# Altium schematic sheet MCU.SchDoc
size 431 x 279 mm; SheetNumber: 5; SheetTotal: 5
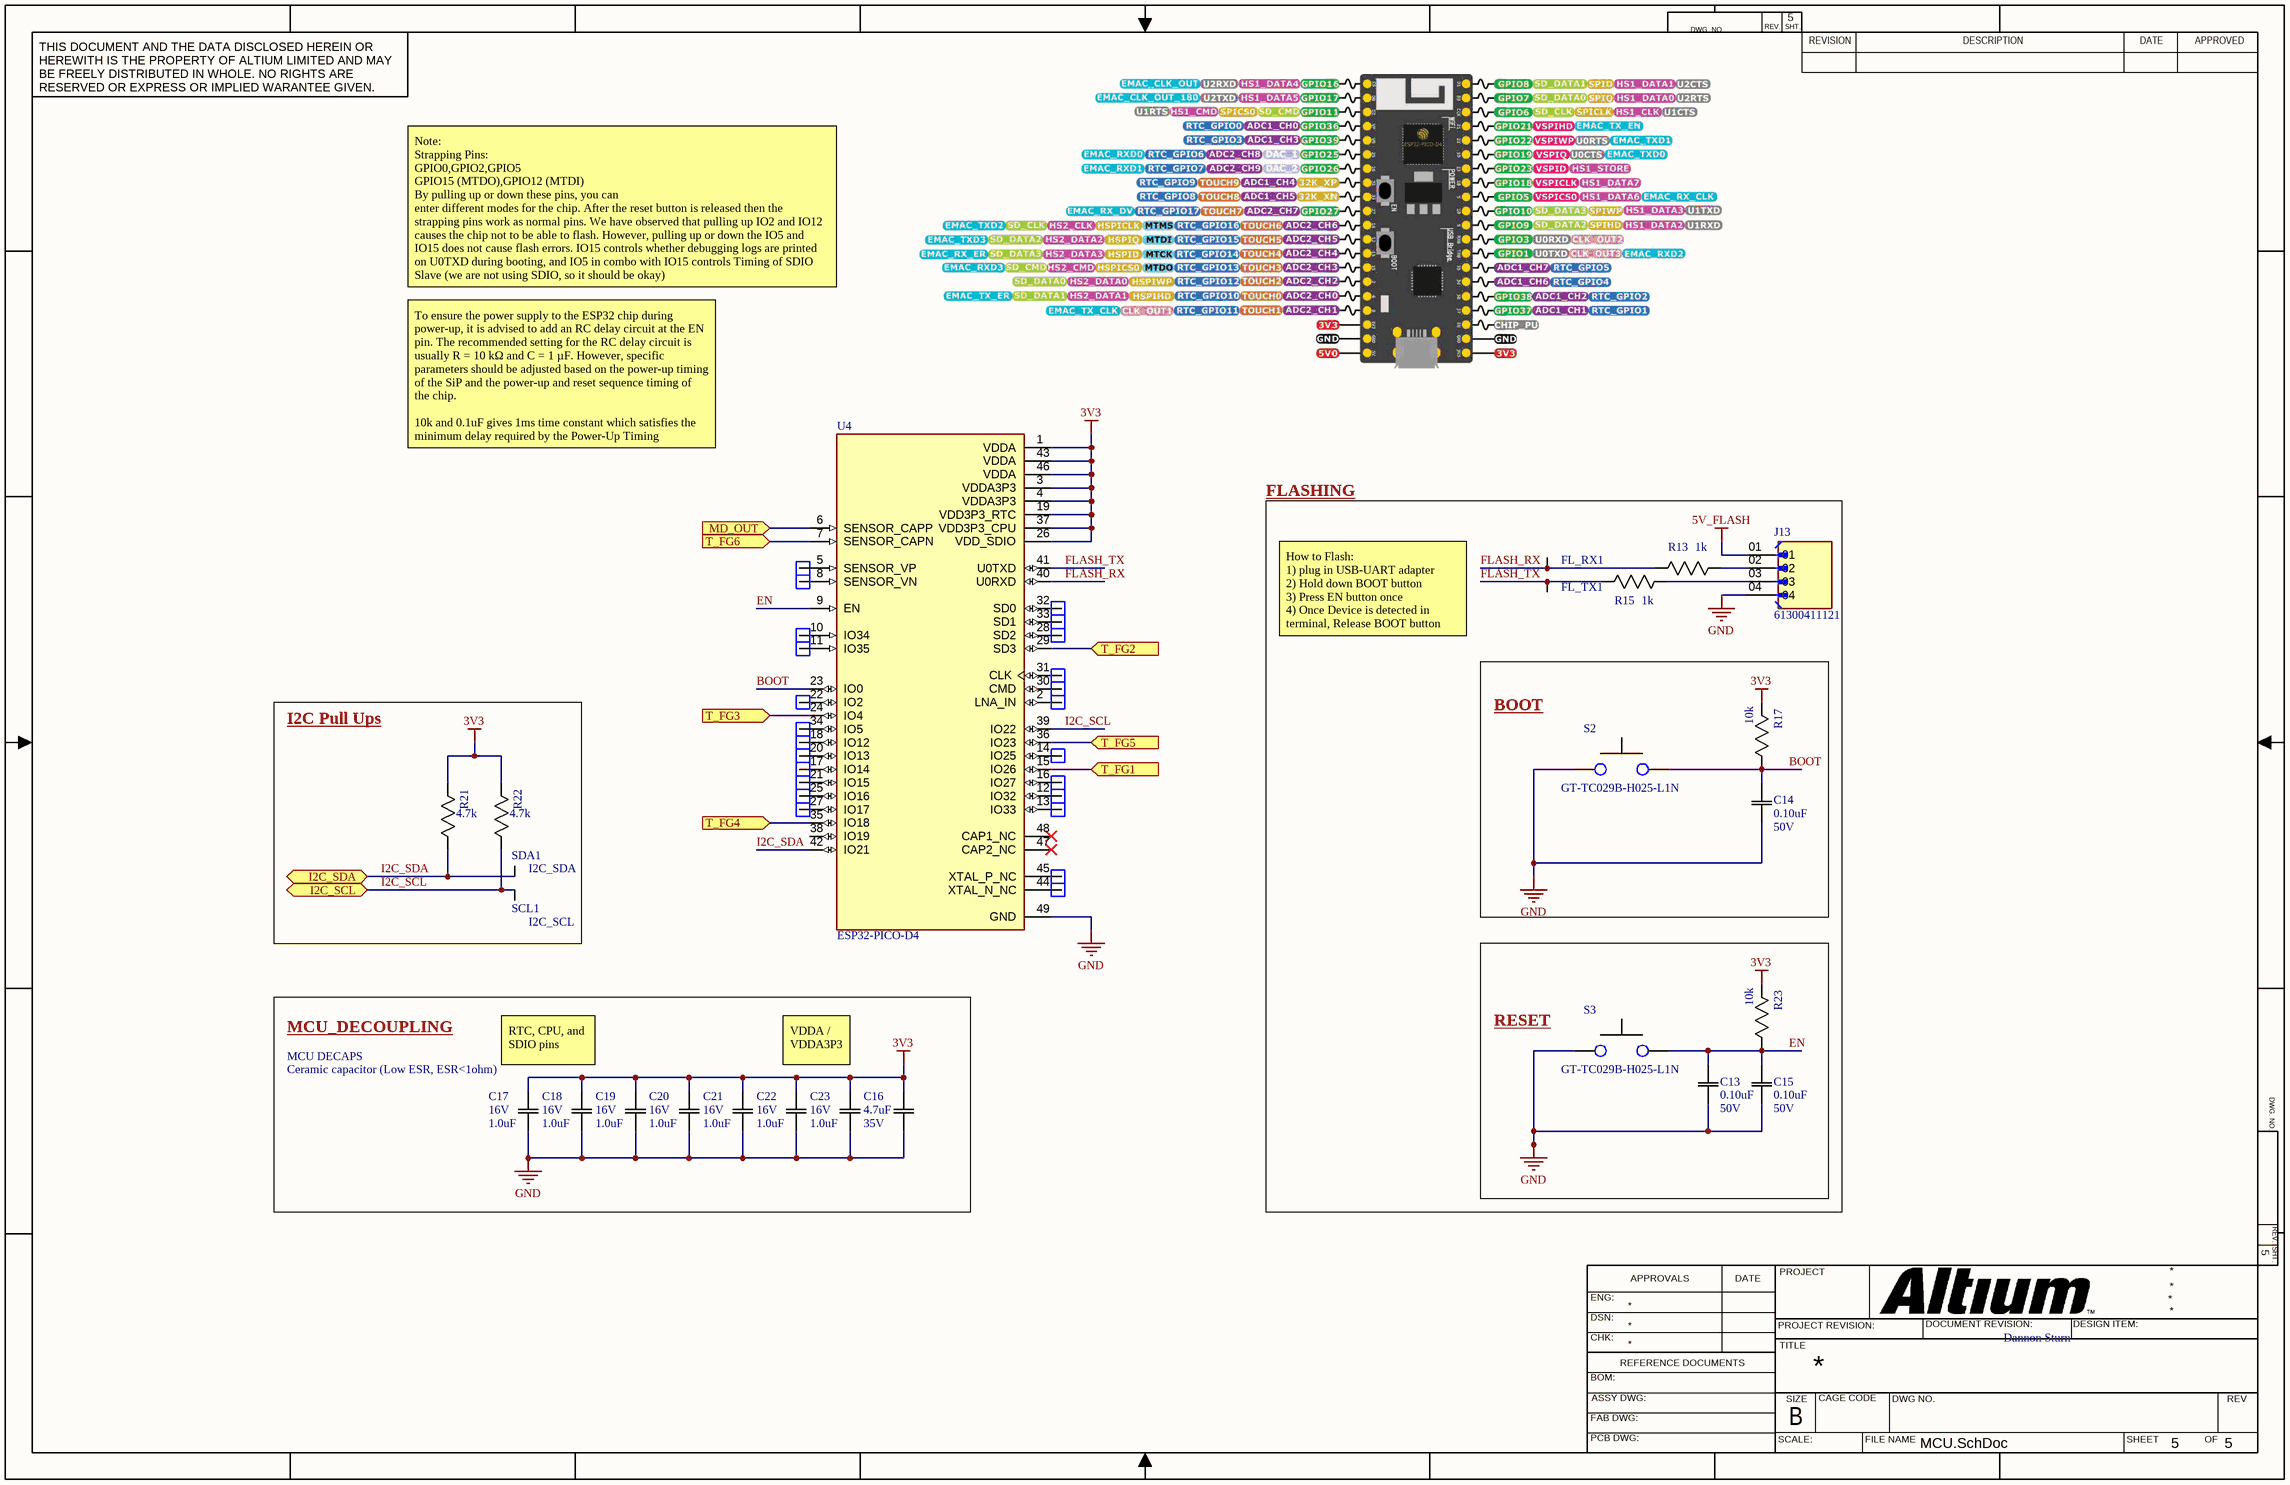
[diagram p0: MCU.SchDoc]

## Parts
1  Breakout Pin 0603  [BreakoutPin 0603]  (value not drawn)
2  Breakout Pin 0603  [BreakoutPin 0603]  (value not drawn)
3  Breakout Pin 0603  [BreakoutPin 0603]  (value not drawn)
4  Breakout Pin 0603  [BreakoutPin 0603]  (value not drawn)
5  Breakout Pin 0603  [BreakoutPin 0603]  (value not drawn)
6  Breakout Pin 0603  [BreakoutPin 0603]  (value not drawn)
7  Breakout Pin 0603  [BreakoutPin 0603]  (value not drawn)
8  Breakout Pin 0603  [BreakoutPin 0603]  (value not drawn)
9  Breakout Pin 0603  [BreakoutPin 0603]  (value not drawn)
10  Breakout Pin 0603  [BreakoutPin 0603]  (value not drawn)
11  Breakout Pin 0603  [BreakoutPin 0603]  (value not drawn)
12  Breakout Pin 0603  [BreakoutPin 0603]  (value not drawn)
13  Breakout Pin 0603  [BreakoutPin 0603]  (value not drawn)
14  Breakout Pin 0603  [BreakoutPin 0603]  (value not drawn)
15  Breakout Pin 0603  [BreakoutPin 0603]  (value not drawn)
16  Breakout Pin 0603  [BreakoutPin 0603]  (value not drawn)
17  Breakout Pin 0603  [BreakoutPin 0603]  (value not drawn)
18  Breakout Pin 0603  [BreakoutPin 0603]  (value not drawn)
19  Breakout Pin 0603  [BreakoutPin 0603]  (value not drawn)
20  Breakout Pin 0603  [BreakoutPin 0603]  (value not drawn)
21  Breakout Pin 0603  [BreakoutPin 0603]  (value not drawn)
22  Breakout Pin 0603  [BreakoutPin 0603]  (value not drawn)
23  Breakout Pin 0603  [BreakoutPin 0603]  (value not drawn)
24  Breakout Pin 0603  [BreakoutPin 0603]  (value not drawn)
C13  Rating: 50V  [0603]  (hidden comment: 0.10uF)
C14  Rating: 50V  [0603]  (hidden comment: 0.10uF)
C15  Rating: 50V  [0805]  (hidden comment: 0.10uF)
C16  Rating: 35V  [0603]  (hidden comment: 4.7uF)
C17  Rating: 16V  [0603]  (hidden comment: 1.0uF)
C18  Rating: 16V  [0603]  (hidden comment: 1.0uF)
C19  Rating: 16V  [0603]  (hidden comment: 1.0uF)
C20  Rating: 16V  [0603]  (hidden comment: 1.0uF)
C21  Rating: 16V  [0603]  (hidden comment: 1.0uF)
C22  Rating: 16V  [0603]  (hidden comment: 1.0uF)
C23  Rating: 16V  [0603]  (hidden comment: 1.0uF)
FL_RX1  Test Point (Via)  [TP]  (value not drawn)  (no BOM)
FL_TX1  Test Point (Via)  [TP]  (value not drawn)  (no BOM)
J13  61300411121  [WURTH_61300411121]
R13  1k  [0603]
R15  1k  [0603]
R17  10k  [0603]
R21  4.7k  [0805]
R22  4.7k  [0805]
R23  10k  [0603]
S2  GT-TC029B-H025-L1N  [SW_EVP-AWCD4A]
S3  GT-TC029B-H025-L1N  [SW_EVP-AWCD4A]
SCL1  I2C_SCL  [TP]  (no BOM)
SDA1  I2C_SDA  [TP]  (no BOM)
U4  ESP32-PICO-D4  [PQFN50P700X700X104-49N - BigPads]

## Blocks framed on the sheet
FLASHING: FL_RX1 FL_TX1 J13 R13 R15
BOOT: C14 R17 S2
I2C Pull Ups: R21 R22 SCL1 SDA1
RESET: C13 C15 R23 S3
MCU_DECOUPLING: C16-C23

## Ports
I2C_SCL (bidir), I2C_SDA (bidir), MD_OUT (in), T_FG1 (in), T_FG2 (in), T_FG3 (in), T_FG4 (in), T_FG5 (in), T_FG6 (in)

## Nets
3V3: C16.2(C2) C17.2(C2) C18.2(C2) C19.2(C2) C20.2(C2) C21.2(C2) C22.2(C2) C23.2(C2) R17.2(R2) R21.2(R2) R22.2(R2) R23.2(R2) U4.1(VDDA) U4.3(VDDA3P3) U4.4(VDDA3P3) U4.19(VDD3P3_RTC) U4.26(VDD_SDIO) U4.37(VDD3P3_CPU) U4.43(VDDA) U4.46(VDDA)
5V_FLASH: J13.01
GND: C13.1(C1) C14.1(C1) C15.1(C1) C16.1(C1) C17.1(C1) C18.1(C1) C19.1(C1) C20.1(C1) C21.1(C1) C22.1(C1) C23.1(C1) J13.04 S2.1 S3.1 U4.49(GND)
BOOT: C14.2(C2) R17.1(R1) S2.2 U4.23(IO0)
EN: C13.2(C2) C15.2(C2) R23.1(R1) S3.2 U4.9(EN)
FLASH_RX: FL_RX1.1 R13.2(R2) U4.40(U0RXD)
FLASH_TX: FL_TX1.1 R15.2(R2) U4.41(U0TXD)
I2C_SCL: R22.1(R1) SCL1.1 U4.39(IO22) ; port I2C_SCL
I2C_SDA: R21.1(R1) SDA1.1 U4.42(IO21) ; port I2C_SDA
MD_OUT: U4.6(SENSOR_CAPP) ; port MD_OUT
T_FG1: U4.15(IO26) ; port T_FG1
T_FG2: U4.29(SD3) ; port T_FG2
T_FG3: U4.24(IO4) ; port T_FG3
T_FG4: U4.35(IO18) ; port T_FG4
T_FG5: U4.36(IO23) ; port T_FG5
T_FG6: U4.7(SENSOR_CAPN) ; port T_FG6
Net1_1: 1.1(BRKOUT) U4.5(SENSOR_VP)
Net2_1: 2.1(BRKOUT) U4.8(SENSOR_VN)
Net3_1: 3.1(BRKOUT) U4.10(IO34)
Net4_1: 4.1(BRKOUT) U4.32(SD0)
Net5_1: 5.1(BRKOUT) U4.11(IO35)
Net6_1: 6.1(BRKOUT) U4.33(SD1)
Net7_1: 7.1(BRKOUT) U4.22(IO2)
Net8_1: 8.1(BRKOUT) U4.31(CLK)
Net9_1: 9.1(BRKOUT) U4.30(CMD)
Net10_1: 10.1(BRKOUT) U4.2(LNA_IN)
Net11_1: 11.1(BRKOUT) U4.18(IO12)
Net12_1: 12.1(BRKOUT) U4.28(SD2)
Net13_1: 13.1(BRKOUT) U4.25(IO16)
Net14_1: 14.1(BRKOUT) U4.27(IO17)
Net15_1: 15.1(BRKOUT) U4.34(IO5)
Net16_1: 16.1(BRKOUT) U4.45(XTAL_P_NC)
Net17_1: 17.1(BRKOUT) U4.44(XTAL_N_NC)
Net18_1: 18.1(BRKOUT) U4.20(IO13)
Net19_1: 19.1(BRKOUT) U4.17(IO14)
Net20_1: 20.1(BRKOUT) U4.21(IO15)
Net21_1: 21.1(BRKOUT) U4.16(IO27)
Net22_1: 22.1(BRKOUT) U4.12(IO32)
Net23_1: 23.1(BRKOUT) U4.13(IO33)
Net24_1: 24.1(BRKOUT) U4.14(IO25)
NetJ13_02: J13.02 R13.1(R1)
NetJ13_03: J13.03 R15.1(R1)

Not connected (* = marked no-connect by the designer): U4 38(IO19) 47(CAP2_NC)* 48(CAP1_NC)*

## Notes on the sheet
- Note:
  Strapping Pins:
  GPIO0,GPIO2,GPIO5
  GPIO15 (MTDO),GPIO12 (MTDI)
  By pulling up or down these pins, you can
  enter different modes for the chip. After the reset button is released then the strapping pins work as normal pins. We have observed that pulling up IO2 and IO12 causes the chip not to be able to flash. However, pulling up or down the IO5 and IO15 does not cause flash errors. IO15 controls whether debugging logs are printed on U0TXD during booting, and IO5 in combo with IO15 controls Timing of SDIO Slave (we are not using SDIO, so it should be okay)
- To ensure the power supply to the ESP32 chip during power-up, it is advised to add an RC delay circuit at the EN pin. The recommended setting for the RC delay circuit is usually R = 10 kΩ and C = 1 µF. However, specific parameters should be adjusted based on the power-up timing of the SiP and the power-up and reset sequence timing of the chip.
  10k and 0.1uF gives 1ms time constant which satisfies the minimum delay required by the Power-Up Timing
- How to Flash:
  1) plug in USB-UART adapter
  2) Hold down BOOT button
  3) Press EN button once
  4) Once Device is detected in terminal, Release BOOT button
- MCU DECAPS
- (near C17) Ceramic capacitor (Low ESR, ESR<1ohm)
- RTC, CPU, and SDIO pins
- VDDA / VDDA3P3
- Dannon Sturn
- DWG. NO.
- REV.
- SHT.
- THIS DOCUMENT AND THE DATA DISCLOSED HEREIN OR HEREWITH IS THE PROPERTY OF ALTIUM LIMITED AND MAY BE FREELY DISTRIBUTED IN WHOLE. NO RIGHTS ARE RESERVED OR EXPRESS OR IMPLIED WARANTEE GIVEN.
- REVISION
- DESCRIPTION
- DATE
- APPROVED
- ENG:
- APPROVALS
- PROJECT
- DSN:
- CHK:
- REFERENCE DOCUMENTS
- PROJECT REVISION:
- TITLE
- DOCUMENT REVISION:
- DESIGN ITEM:
- BOM:
- FAB DWG:
- PCB DWG:
- ASSY DWG:
- SCALE:
- SIZE
- B
- CAGE CODE
- FILE NAME
- DWG NO.
- SHEET
- OF
- REV

## Library data of the parts
1-24 = Breakout Pin 0603: 0603 breakout pad; Part Number: Breakout Pin 0603
C13-C15 = CAP 0.1uF 50V: Default Symbol for Capacitors; Temperature Coefficient: X7R; Tolerance: 10%; Value: 0.10uF; Part Number: CAP 0.1uF 50V
C16 = CAP 4.7uF 35V: CAP CER 4.7UF 35V X7R 0603/0805; Tolerance: 10%; Package: 0603/0805; Temperature Coefficient: X7R; Operating Temperature: -55°C ~ 125°C; Value: 4.7uF; Part Number: CAP 4.7uF 35V
C17-C23 = CAP 1.0uF 16V: CAP CER 1.0UF 16V X5R 0603/0805; Tolerance: 10%; Package: 0603/0805; Temperature Coefficient: X5R; Operating Temperature: -55°C ~ 85°C; Value: 1.0uF; Part Number: CAP 1.0uF 16V
J13 = 61300411121: Connector Header Through Hole 4 position 0.100 (2.54mm); MF: Wurth Electronics; SnapEDA_Link: https://www.snapeda.com/parts/61300411121/Wurth+Electronics+Inc./view-part/?ref=snap; Package: None; Value: *; MP: 61300411121; Check_prices: https://www.snapeda.com/parts/61300411121/Wurth+Electronics+Inc./view-part/?ref=eda
R13 R15 = RES 1k 1/8W: Default Resistor Symbol; Manufacturer Part Number 1: MCT06030C1001FP500; Power (Watts): 0.125W; Tolerance: 1%; Package: 0805; Value: 1k; Part Number: RES 1k 1/8W; Supplier 1: Digi-Key; Supplier Part Number 1: MCT0603-1.00K-CFCT-ND; Supplier URL 1: https://www.digikey.ca/en/products/detail/vishay-beyschlag-draloric-bc-components/MCT06030C1001FP500/2607821?s=N4IgTCBcDaILIGEAqAGAbCgzAWgIwDoUUBpbBAMWWwDkAREAXQF8g
R17 R23 = RES 10k 1/8W - 5%: RES SMD 10K OHM 5% 1/8W 0603; Power (Watts): 0.125W; Package: 0805; Value: 10k; Tolerance: 5%; Part Number: RES 10k 1/8W - 5%
R21 R22 = RES 4.7k 1/8W - 1%: Default Resistor Symbol; Manufacturer Part Number 1: RMCF0603FT4K70; Power (Watts): 0.125W; Tolerance: 1%; Package: 0805; Value: 4.7k; Part Number: RES 4.7k 1/8W - 1%; Supplier 1: Digi-Key; Supplier Part Number 1: RMCF0603FT4K70CT-ND; Supplier URL 1: https://www.digikey.ca/en/products/detail/stackpole-electronics-inc/RMCF0603FT4K70/1760998
S2 S3 = GT-TC029B-H025-L1N: JLC Supplied: 50mA 3.9mm 100MΩ 100,000 Times 12V 250gf 2.9mm 2.5mm Round Button; MP: EVP-AWCD4A; Package: None; Price: None; Value: *; Availability: Unavailable
SCL1 SDA1 = Test Point (Via): Part Number: Test Point (Via)
U4 = ESP32-PICO-D4: RX TXRX MOD WIFI SURFACE MOUNT; MF: Espressif Systems; MP: ESP32-PICO-D4; Package: SMD-48 Espressif Systems; Availability: Warning; Price: None; Purchase-URL: https://pricing.snapeda.com/search/part/ESP32-PICO-D4/?ref=eda; Check_prices: https://www.snapeda.com/parts/ESP32-PICO-D4/Espressif%20Systems/view-part/2762121/?ref=eda; SnapEDA_Link: https://www.snapeda.com/parts/ESP32-PICO-D4/Espressif%20Systems/view-part/2762121/?ref=snap; Value: *; Part Number: ESP32-PICO-D4; Manufacturer Part Number 1: ESP32-PICO-D4; Supplier 1: Digi-key; Supplier Part Number 1: 1904-1029-1-ND; Supplier URL 1: https://www.digikey.com/en/products/detail/espressif-systems/ESP32-PICO-D4/9381722
FL_RX1 FL_TX1 = Test Point (Via): Part Number: Test Point (Via)